# EasyEDA schematic SCH_Pocket Jammer_2024-07-12.json
TITLE: Sheet_1; REV: 1.0; Date: 2024-07-12; Sheet: 1/1; Company: Your Company
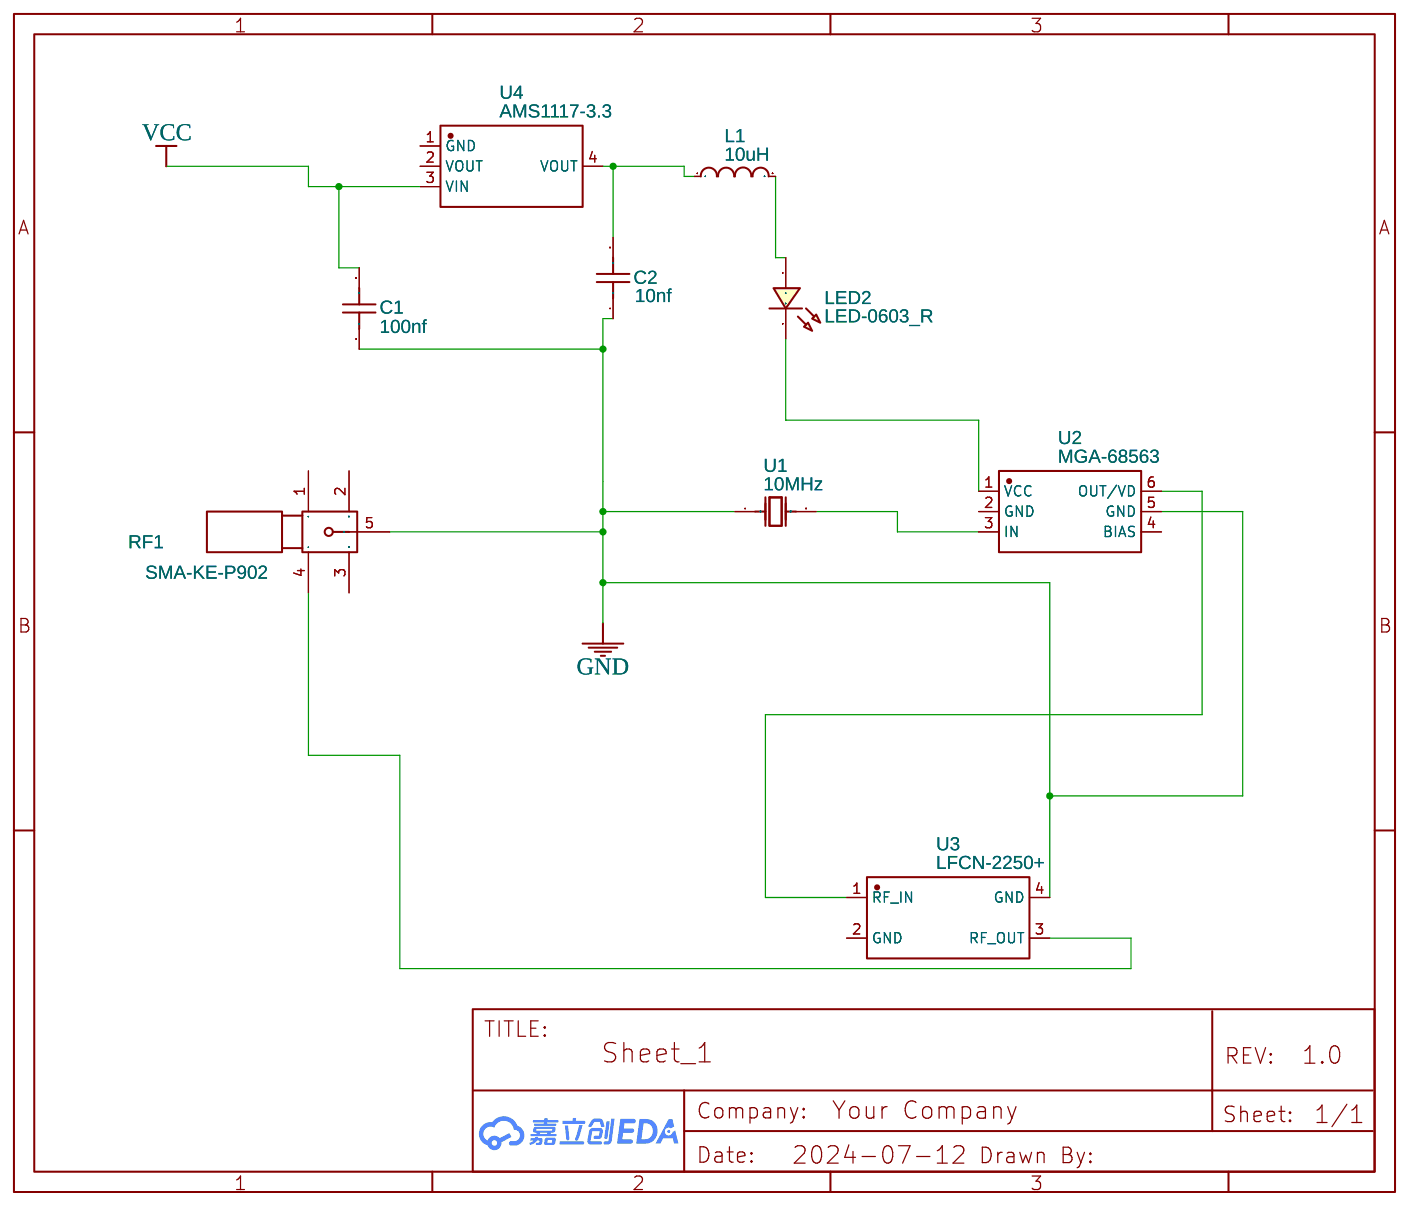
[diagram p0: schematic sheet]

## Parts
C1  100nf  [C0603]
C2  10nf  [C0603]
L1  10uH  [L0603]
LED2  LED-0603_R  [LED0603_RED]
RF1  SMA-KE-P902  [SMA-TH_SMA-KE-P902]
U1  10MHz  [HC-49S_L11.4-W4.8-LS13.0]
U2  MGA-68563  [SOT-363_L2.0-W1.3-P0.65-LS2.1-BL]
U3  LFCN-2250+  [FILTER-SMD_1206-4P-L3.2-W1.6-L_LFCN-XX]
U4  AMS1117-3.3  [SOT-223-3_L6.5-W3.4-P2.30-LS7.0-BR]

## Library data of the parts
C1 C2 = C_0603_US: Contributor: LCEDA_Lib
L1 = L0603_US: Contributor: LCEDA_Lib
LED2 = LED-0603_R: Manufacturer: EVERLIGHT(台湾亿光); Manufacturer Part: 19-217/R6C-AL1M2VY/3T; Supplier Part: C72044; Supplier: LCSC; Contributor: LCEDA_01
RF1 = SMA-KE-P902: Contributor: LCSC; Supplier: LCSC; Supplier Part: C914557; Manufacturer: DreamLNK(骏晔科技); JLCPCB Part Class: Extended Part
U1 = ECS-100-20-5PVX: Contributor: lcsc; Supplier: LCSC; Supplier Part: C2450864; Manufacturer: ECS; JLCPCB Part Class: Extended Part
U2 = MGA-68563: JLCPCB Part Class: Extended Part; Contributor: LCSC; Supplier: LCSC; Supplier Part: C2838514; Manufacturer: null
U3 = LFCN-2250+: LINK: https://img.jlc.com/pdf/applyPasteComponent/2021-12-16/1563596A/a9cc0894c31746e99a719e99a39a7bb4/LFCN-2250.pdf; Contributor: LCSC; Supplier: LCSC; Supplier Part: C9900004163; Manufacturer: null
U4 = AMS1117-3.3: sourceId: dwIGgezVh; Supplier: LCSC; Manufacturer: AMS; Supplier Part: C6186; JLCPCB Part Class: Basic Part

## Nets
GND: C1.1 C2.1 RF1.5 U1.1(OSC1) U2.5(GND) U3.4(GND)
VCC: C1.2 U4.3(VIN)
Net-(C2-2): C2.2 L1.1 U4.4(VOUT)
Net-(L1-2): L1.2 LED2.1
Net-(LED2-2): LED2.2 U2.1(VCC)
Net-(RF1-4): RF1.4 U3.3(RF OUT)
Net-(U1-2): U1.2(OSC2) U2.3(IN)
Net-(U2-6): U2.6(OUT/VD) U3.1(RF IN)

Not connected (* = marked no-connect by the designer): RF1 1 2 3; U2 2(GND) 4(BIAS); U3 2(GND); U4 1(GND) 2(VOUT)
